# Altium schematic sheet C.SchDoc
size A
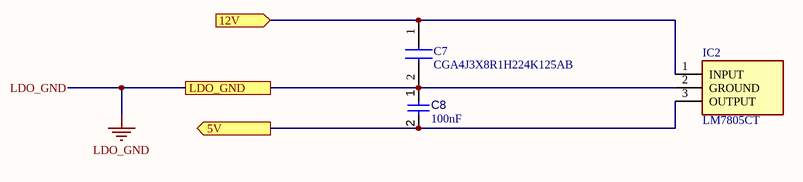
[diagram p0: C.SchDoc]

## Parts
C7  CGA4J3X8R1H224K125AB  [CGA4J2NP01H223J125AA]
C8  value 100nF  [CAPC2013X95X50LL10T25]  (hidden comment: Capacitor 100 nF +/-10% 50 V 0805)
IC2  LM7805CT  [TO254P470X1028X1955-3P]

## Ports
5V (out), 12V (in), LDO_GND

## Nets
LDO_GND: C7.2 C8.1 IC2.2(GROUND) ; port LDO_GND
5V: C8.2 IC2.3(OUTPUT) ; port 5V
12V: C7.1 IC2.1(INPUT) ; port 12V

## Library data of the parts
C7 = CGA4J3X8R1H224K125AB: Capacitor; Manufacturer_Name: TDK; Datasheet Link: http://docs-europe.electrocomponents.com/webdocs/14e9/0900766b814e9125.pdf; Height: 1.45mm; Manufacturer_Part_Number: CGA4J3X8R1H224K125AB; Mouser Part Number: 810-CGA4J3X8R1H224KB; Mouser Price/Stock: https://www.mouser.co.uk/ProductDetail/TDK/CGA4J3X8R1H224K125AB?qs=7GgVL%252Bg%252BDMFbtll9V%2FTLEA%3D%3D
C8 = CMP-001-00018-6: Chip Capacitor, 100 nF, +/- 10%, 50 V, 0805 (2012 Metric); Capacitor Type: Ceramic; Voltage Rating: 50V; Pins: 2; Max Operating Temperature: 125°C; Min Operating Temperature: -55°C; Mounting Technology: SM; Case/Package: 0805; RoHS Compliant: True; Tolerance: 10%
IC2 = LM7805CT: Integrated Circuit; Manufacturer_Name: Texas Instruments; Datasheet Link: http://www.ti.com/lit/ds/symlink/lm340.pdf; Height: 4.7mm; Manufacturer_Part_Number: LM7805CT; Mouser Part Number: 926-LM7805CT; Mouser Price/Stock: https://www.mouser.co.uk/ProductDetail/Texas-Instruments/LM7805CT?qs=QbsRYf82W3EaqXeMDVwIfQ%3D%3D; Arrow Part Number: LM7805CT; Arrow Price/Stock: https://www.arrow.com/en/products/lm7805ct/texas-instruments?region=europe